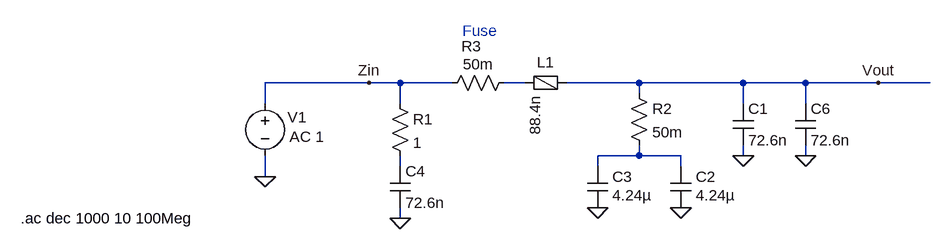
[diagram p0: schematic inputFilter.asc]
inputFilter.asc, the LTspice schematic file:
Version 4
SHEET 1 1408 680
WIRE 160 144 0 144
WIRE 208 144 160 144
WIRE 288 144 208 144
WIRE 400 144 368 144
WIRE 576 144 464 144
WIRE 736 144 576 144
WIRE 832 144 736 144
WIRE 944 144 832 144
WIRE 1024 144 944 144
WIRE 576 160 576 144
WIRE 0 176 0 144
WIRE 208 176 208 144
WIRE 736 176 736 144
WIRE 832 176 832 144
WIRE 576 256 576 240
WIRE 576 256 512 256
WIRE 640 256 576 256
WIRE 736 256 736 240
WIRE 832 256 832 240
WIRE 208 272 208 256
WIRE 512 272 512 256
WIRE 640 272 640 256
WIRE 0 288 0 256
WIRE 208 352 208 336
FLAG 736 256 0
FLAG 640 336 0
FLAG 512 336 0
FLAG 832 256 0
FLAG 160 144 Zin
FLAG 208 352 0
FLAG 0 288 0
FLAG 944 144 Vout
SYMBOL FerriteBead 432 144 R90
WINDOW 0 -16 0 VBottom 2
SYMATTR InstName L1
SYMATTR Value 88.4n
SYMATTR SpiceLine Rser=4m Rpar=37 Cpar=1.2p
SYMBOL cap 720 176 R0
SYMATTR InstName C1
SYMATTR Value 72.6n
SYMATTR SpiceLine Rser=25.1m Lser=381.7p
SYMBOL cap 624 272 R0
WINDOW 0 39 16 Left 2
WINDOW 3 39 45 Left 2
SYMATTR InstName C2
SYMATTR Value 4.24µ
SYMATTR SpiceLine Rser=2.9m Lser=1.1n
SYMBOL cap 496 272 R0
WINDOW 0 39 16 Left 2
WINDOW 3 39 45 Left 2
SYMATTR InstName C3
SYMATTR Value 4.24µ
SYMATTR SpiceLine Rser=2.9m Lser=1.1n
SYMBOL cap 816 176 R0
SYMATTR InstName C6
SYMATTR Value 72.6n
SYMATTR SpiceLine Rser=25.1m Lser=381.7p
SYMBOL res 560 144 R0
SYMATTR InstName R2
SYMATTR Value 50m
SYMBOL res 384 128 R90
WINDOW 0 -25 66 VBottom 2
WINDOW 3 -28 56 VTop 2
SYMATTR InstName R3
SYMATTR Value 50m
SYMBOL cap 192 272 R0
SYMATTR InstName C4
SYMATTR Value 72.6n
SYMATTR SpiceLine Rser=25.1m Lser=381.7p
SYMBOL res 192 160 R0
SYMATTR InstName R1
SYMATTR Value 1
SYMBOL voltage 0 160 R0
WINDOW 0 35 37 Left 2
WINDOW 3 38 67 Left 2
SYMATTR InstName V1
SYMATTR Value AC 1
TEXT -376 352 Left 2 !.ac dec 1000 10 100Meg
TEXT 304 64 Left 2 ;Fuse

The netlist it stands for:
* inputFilter.asc
L1 Vout N001 88.4n Rser=4m Rpar=37 Cpar=1.2p
C1 Vout 0 72.6n Rser=25.1m Lser=381.7p
C2 N002 0 4.24µ Rser=2.9m Lser=1.1n
C3 N002 0 4.24µ Rser=2.9m Lser=1.1n
C6 Vout 0 72.6n Rser=25.1m Lser=381.7p
R2 Vout N002 50m
R3 N001 Zin 50m
C4 N003 0 72.6n Rser=25.1m Lser=381.7p
R1 Zin N003 1
V1 Zin 0 AC 1
.ac dec 1000 10 100Meg
* Fuse
.backanno
.end